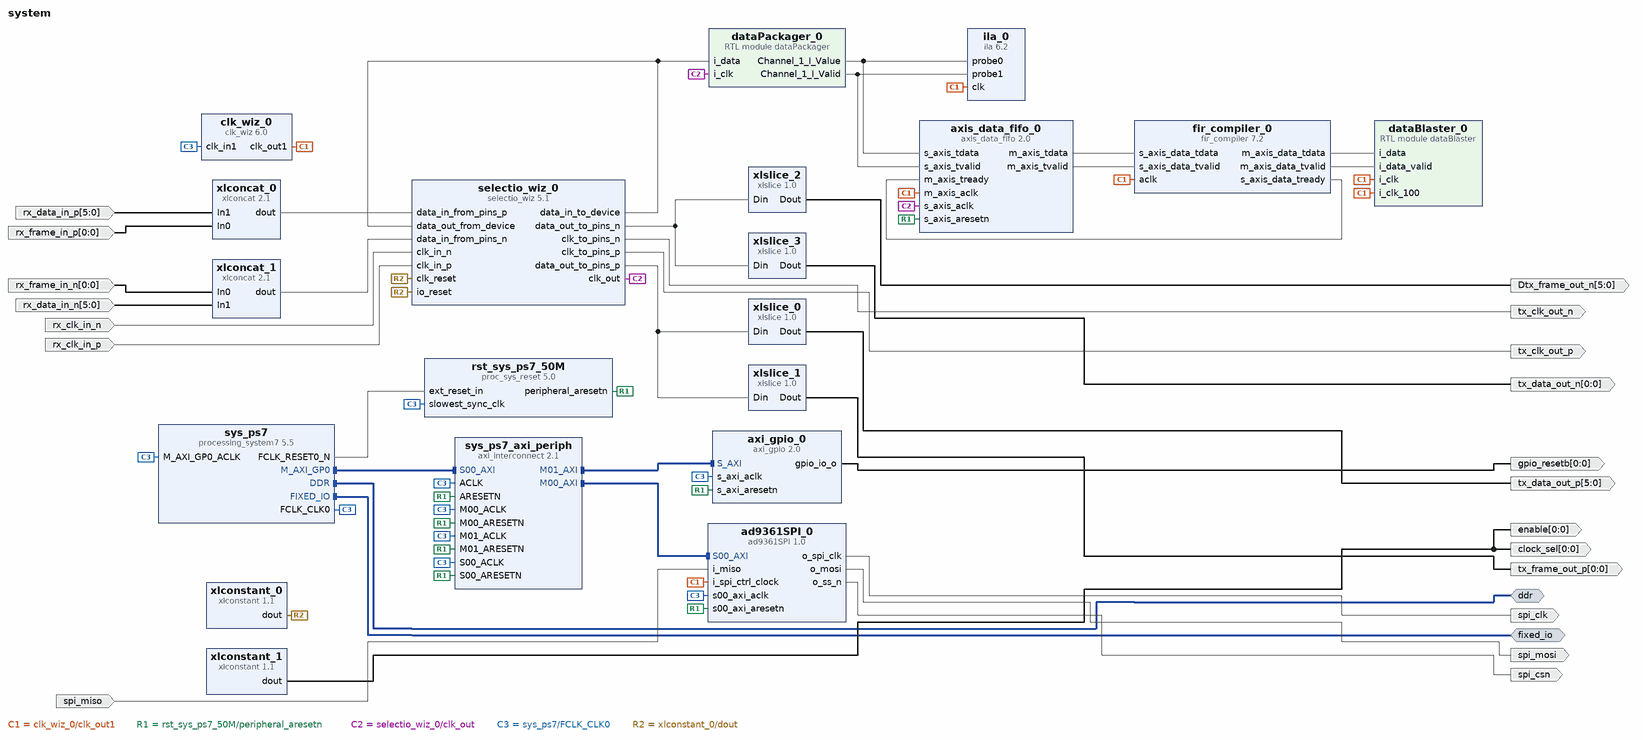
[diagram p0: block diagram of the top level]
# Vivado block design system, xc7z035ifbg676-2L, Vivado 2021.1
create_bd_design system

create_bd_intf_port -mode Master -vlnv xilinx.com:interface:ddrx_rtl:1.0 ddr
create_bd_intf_port -mode Master -vlnv xilinx.com:display_processing_system7:fixedio_rtl:1.0 fixed_io
create_bd_port -dir O spi_mosi
create_bd_port -dir O spi_csn
create_bd_port -dir O -type clk spi_clk
set_property -dict {CONFIG.FREQ_HZ 10000000} [get_bd_ports spi_clk]
create_bd_port -dir I spi_miso
create_bd_port -dir O -from 0 -to 0 gpio_resetb
create_bd_port -dir I -type clk rx_clk_in_n
create_bd_port -dir I -type clk rx_clk_in_p
create_bd_port -dir I -from 0 -to 0 rx_frame_in_p
create_bd_port -dir I -from 5 -to 0 rx_data_in_p
create_bd_port -dir I -from 0 -to 0 rx_frame_in_n
create_bd_port -dir I -from 5 -to 0 rx_data_in_n
create_bd_port -dir O -from 5 -to 0 tx_data_out_p
create_bd_port -dir O -from 0 -to 0 tx_frame_out_p
create_bd_port -dir O -from 5 -to 0 Dtx_frame_out_n
create_bd_port -dir O -from 0 -to 0 tx_data_out_n
create_bd_port -dir O -type clk tx_clk_out_p
create_bd_port -dir O -type clk tx_clk_out_n
create_bd_port -dir O -from 0 -to 0 enable
create_bd_port -dir O -from 0 -to 0 clock_sel

create_bd_cell -type ip -vlnv xilinx.com:ip:processing_system7:5.5 sys_ps7
set_property -dict [list \
  CONFIG.PCW_APU_PERIPHERAL_FREQMHZ 666.666666 \
  CONFIG.PCW_CPU_CPU_6X4X_MAX_RANGE 800 \
  CONFIG.PCW_ENET0_PERIPHERAL_ENABLE 0 \
  CONFIG.PCW_ENET1_PERIPHERAL_CLKSRC External \
  CONFIG.PCW_FPGA0_PERIPHERAL_FREQMHZ 100 \
  CONFIG.PCW_FPGA1_PERIPHERAL_FREQMHZ 200.0 \
  CONFIG.PCW_FPGA2_PERIPHERAL_FREQMHZ 200.0 \
  CONFIG.PCW_GPIO_MIO_GPIO_ENABLE 0 \
  CONFIG.PCW_IRQ_F2P_INTR 1 \
  CONFIG.PCW_IRQ_F2P_MODE REVERSE \
  CONFIG.PCW_PERIPHERAL_BOARD_PRESET None \
  CONFIG.PCW_PRESET_BANK0_VOLTAGE {LVCMOS 1.8V} \
  CONFIG.PCW_PRESET_BANK1_VOLTAGE {LVCMOS 1.8V} \
  CONFIG.PCW_QSPI_PERIPHERAL_ENABLE 0 \
  CONFIG.PCW_SD0_PERIPHERAL_ENABLE 0 \
  CONFIG.PCW_UART1_PERIPHERAL_ENABLE 1 \
  CONFIG.PCW_UART1_UART1_IO {MIO 48 .. 49} \
  CONFIG.PCW_UART_PERIPHERAL_FREQMHZ 100 \
  CONFIG.PCW_UIPARAM_DDR_FREQ_MHZ 533.333333 \
  CONFIG.PCW_UIPARAM_DDR_PARTNO {MT41K256M16 RE-125} \
  CONFIG.PCW_USB0_PERIPHERAL_ENABLE 0 \
  CONFIG.PCW_USE_FABRIC_INTERRUPT 1 \
  CONFIG.preset None \
] [get_bd_cells sys_ps7]
# 343 more settings of sys_ps7 are not shown: defaults, MIO pin electricals, DDR timing, and values the tool derives
create_bd_cell -type ip -vlnv xilinx.com:ip:axi_interconnect:2.1 sys_ps7_axi_periph
set_property -dict {CONFIG.NUM_MI 2} [get_bd_cells sys_ps7_axi_periph]
create_bd_cell -type ip -vlnv xilinx.com:ip:proc_sys_reset:5.0 rst_sys_ps7_50M
create_bd_cell -type ip -vlnv xilinx.com:ip:clk_wiz:6.0 clk_wiz_0
set_property -dict [list \
  CONFIG.CLKIN1_JITTER_PS 100.0 \
  CONFIG.CLKOUT1_JITTER 290.478 \
  CONFIG.CLKOUT1_PHASE_ERROR 133.882 \
  CONFIG.CLKOUT1_REQUESTED_OUT_FREQ 10.000 \
  CONFIG.MMCM_CLKFBOUT_MULT_F 15.625 \
  CONFIG.MMCM_CLKIN1_PERIOD 10.000 \
  CONFIG.MMCM_CLKIN2_PERIOD 10.000 \
  CONFIG.MMCM_CLKOUT0_DIVIDE_F 78.125 \
  CONFIG.MMCM_DIVCLK_DIVIDE 2 \
  CONFIG.USE_LOCKED false \
  CONFIG.USE_RESET false \
] [get_bd_cells clk_wiz_0]
create_bd_cell -type ip -vlnv xilinx.com:ip:axi_gpio:2.0 axi_gpio_0
set_property -dict {CONFIG.C_ALL_OUTPUTS 1 CONFIG.C_DOUT_DEFAULT 0x00000001 CONFIG.C_GPIO_WIDTH 1} [get_bd_cells axi_gpio_0]
create_bd_cell -type ip -vlnv xilinx.com:ip:selectio_wiz:5.1 selectio_wiz_0
set_property -dict [list \
  CONFIG.BUS_DIR SEPARATE \
  CONFIG.BUS_IO_STD LVDS \
  CONFIG.BUS_SIG_TYPE DIFF \
  CONFIG.CLK_FWD true \
  CONFIG.CLK_FWD_IO_STD LVDS \
  CONFIG.CLK_FWD_SIG_TYPE DIFF \
  CONFIG.SELIO_ACTIVE_EDGE DDR \
  CONFIG.SELIO_BUS_IN_DELAY NONE \
  CONFIG.SELIO_CLK_IO_STD LVDS \
  CONFIG.SELIO_CLK_SIG_TYPE DIFF \
  CONFIG.SELIO_DDR_ALIGNMENT OPPOSITE_EDGE \
  CONFIG.SELIO_INTERFACE_TYPE NETWORKING \
  CONFIG.SELIO_ODDR_ALIGNMENT OPPOSITE_EDGE \
  CONFIG.SERIALIZATION_FACTOR 4 \
  CONFIG.SYSTEM_DATA_WIDTH 7 \
] [get_bd_cells selectio_wiz_0]
create_bd_cell -type ip -vlnv xilinx.com:ip:xlconcat:2.1 xlconcat_0
set_property -dict {CONFIG.IN0_WIDTH 1 CONFIG.IN1_WIDTH 6} [get_bd_cells xlconcat_0]
create_bd_cell -type ip -vlnv xilinx.com:ip:xlconcat:2.1 xlconcat_1
set_property -dict {CONFIG.IN0_WIDTH 1 CONFIG.IN1_WIDTH 6} [get_bd_cells xlconcat_1]
create_bd_cell -type ip -vlnv xilinx.com:ip:xlconstant:1.1 xlconstant_0
set_property -dict {CONFIG.CONST_VAL 0} [get_bd_cells xlconstant_0]
create_bd_cell -type ip -vlnv xilinx.com:ip:xlslice:1.0 xlslice_0
set_property -dict {CONFIG.DIN_FROM 6 CONFIG.DIN_TO 1 CONFIG.DIN_WIDTH 7 CONFIG.DOUT_WIDTH 6} [get_bd_cells xlslice_0]
create_bd_cell -type ip -vlnv xilinx.com:ip:xlslice:1.0 xlslice_1
set_property -dict {CONFIG.DIN_WIDTH 7} [get_bd_cells xlslice_1]
create_bd_cell -type ip -vlnv xilinx.com:ip:xlslice:1.0 xlslice_2
set_property -dict {CONFIG.DIN_FROM 6 CONFIG.DIN_TO 1 CONFIG.DIN_WIDTH 7 CONFIG.DOUT_WIDTH 6} [get_bd_cells xlslice_2]
create_bd_cell -type ip -vlnv xilinx.com:ip:xlslice:1.0 xlslice_3
set_property -dict {CONFIG.DIN_WIDTH 7} [get_bd_cells xlslice_3]
create_bd_cell -type ip -vlnv xilinx.com:ip:xlconstant:1.1 xlconstant_1
create_bd_cell -type ip -vlnv xilinx.com:user:ad9361SPI:1.0 ad9361SPI_0
create_bd_cell -type module -reference dataPackager dataPackager_0
create_bd_cell -type ip -vlnv xilinx.com:ip:fir_compiler:7.2 fir_compiler_0
set_property -dict [list \
  CONFIG.BestPrecision false \
  CONFIG.Clock_Frequency 10 \
  CONFIG.CoefficientVector -9.84925826310081e-05,-0.00110868863542213,-0.00360880865416567,-0.00738997179946688,-0.0105821355373124,-0.0104770713158961,-0.00576969500974908,0.00146429798420476,0.00643664485734270,0.00533981936990165,-0.000819920483685010,-0.00628361278568368,-0.00546718426875868,0.00134326282720413,0.00746917261520295,0.00607762211423573,-0.00236982350206959,-0.00946259607779683,-0.00694148672694505,0.00395630902383487,0.0122354284456056,0.00792249159172272,-0.00634207600108948,-0.0159719042373950,-0.00891354338210485,0.00997947924793755,0.0211410628800746,0.00983603012199917,-0.0157534148009865,-0.0288344572866765,-0.0106367968557134,0.0257925713549861,0.0420529150204102,0.0112543877848733,-0.0473372555721501,-0.0729943026596861,-0.0116281947059571,0.131135621874419,0.281121067168514,0.345106159081915,0.281121067168514,0.131135621874419,-0.0116281947059571,-0.0729943026596861,-0.0473372555721501,0.0112543877848733,0.0420529150204102,0.0257925713549861,-0.0106367968557134,-0.0288344572866765,-0.0157534148009865,0.00983603012199917,0.0211410628800746,0.00997947924793755,-0.00891354338210485,-0.0159719042373950,-0.00634207600108948,0.00792249159172272,0.0122354284456056,0.00395630902383487,-0.00694148672694505,-0.00946259607779683,-0.00236982350206959,0.00607762211423573,0.00746917261520295,0.00134326282720413,-0.00546718426875868,-0.00628361278568368,-0.000819920483685010,0.00533981936990165,0.00643664485734270,0.00146429798420476,-0.00576969500974908,-0.0104770713158961,-0.0105821355373124,-0.00738997179946688,-0.00360880865416567,-0.00110868863542213,-9.84925826310081e-05 \
  CONFIG.Coefficient_Fractional_Bits 49 \
  CONFIG.Coefficient_Sets 1 \
  CONFIG.Coefficient_Sign Signed \
  CONFIG.Coefficient_Structure Inferred \
  CONFIG.Coefficient_Width 49 \
  CONFIG.ColumnConfig 2 \
  CONFIG.Data_Fractional_Bits 10 \
  CONFIG.Data_Sign Signed \
  CONFIG.Data_Width 12 \
  CONFIG.Decimation_Rate 2 \
  CONFIG.Filter_Architecture Systolic_Multiply_Accumulate \
  CONFIG.Filter_Type Decimation \
  CONFIG.Interpolation_Rate 1 \
  CONFIG.Number_Channels 1 \
  CONFIG.Output_Rounding_Mode Truncate_LSBs \
  CONFIG.Output_Width 16 \
  CONFIG.Quantization Quantize_Only \
  CONFIG.RateSpecification Frequency_Specification \
  CONFIG.Sample_Frequency 0.768 \
  CONFIG.Zero_Pack_Factor 1 \
] [get_bd_cells fir_compiler_0]
create_bd_cell -type ip -vlnv xilinx.com:ip:axis_data_fifo:2.0 axis_data_fifo_0
set_property -dict {CONFIG.FIFO_DEPTH 256 CONFIG.IS_ACLK_ASYNC 1 CONFIG.TDATA_NUM_BYTES 2} [get_bd_cells axis_data_fifo_0]
create_bd_cell -type module -reference dataBlaster dataBlaster_0
create_bd_cell -type ip -vlnv xilinx.com:ip:ila:6.2 ila_0
set_property -dict [list \
  CONFIG.C_DATA_DEPTH 4096 \
  CONFIG.C_ENABLE_ILA_AXI_MON false \
  CONFIG.C_MONITOR_TYPE Native \
  CONFIG.C_NUM_OF_PROBES 2 \
] [get_bd_cells ila_0]

# ---- connections ----

connect_bd_intf_net [get_bd_intf_ports ddr] [get_bd_intf_pins sys_ps7/DDR]
connect_bd_intf_net [get_bd_intf_ports fixed_io] [get_bd_intf_pins sys_ps7/FIXED_IO]
connect_bd_intf_net [get_bd_intf_pins sys_ps7/M_AXI_GP0] [get_bd_intf_pins sys_ps7_axi_periph/S00_AXI]
connect_bd_intf_net [get_bd_intf_pins sys_ps7_axi_periph/M00_AXI] [get_bd_intf_pins ad9361SPI_0/S00_AXI]
connect_bd_intf_net [get_bd_intf_pins sys_ps7_axi_periph/M01_AXI] [get_bd_intf_pins axi_gpio_0/S_AXI]
connect_bd_net -net In0_1_1 [get_bd_ports rx_frame_in_n] [get_bd_pins xlconcat_1/In0]
connect_bd_net -net In1_0_1 [get_bd_ports rx_data_in_p] [get_bd_pins xlconcat_0/In1]
connect_bd_net -net In1_1_1 [get_bd_ports rx_data_in_n] [get_bd_pins xlconcat_1/In1]
connect_bd_net [get_bd_pins fir_compiler_0/s_axis_data_tready] [get_bd_pins axis_data_fifo_0/m_axis_tready]
connect_bd_net [get_bd_pins ad9361SPI_0/o_mosi] [get_bd_ports spi_mosi]
connect_bd_net [get_bd_pins ad9361SPI_0/o_spi_clk] [get_bd_ports spi_clk]
connect_bd_net [get_bd_pins ad9361SPI_0/o_ss_n] [get_bd_ports spi_csn]
connect_bd_net [get_bd_pins axi_gpio_0/gpio_io_o] [get_bd_ports gpio_resetb]
connect_bd_net [get_bd_pins axis_data_fifo_0/m_axis_tdata] [get_bd_pins fir_compiler_0/s_axis_data_tdata]
connect_bd_net [get_bd_pins axis_data_fifo_0/m_axis_tvalid] [get_bd_pins fir_compiler_0/s_axis_data_tvalid]
connect_bd_net -net clk_in_n_0_1 [get_bd_ports rx_clk_in_n] [get_bd_pins selectio_wiz_0/clk_in_n]
connect_bd_net -net clk_in_p_0_1 [get_bd_ports rx_clk_in_p] [get_bd_pins selectio_wiz_0/clk_in_p]
connect_bd_net [get_bd_pins clk_wiz_0/clk_out1] \
  [get_bd_pins ad9361SPI_0/i_spi_ctrl_clock] [get_bd_pins axis_data_fifo_0/m_axis_aclk] [get_bd_pins fir_compiler_0/aclk] \
  [get_bd_pins dataBlaster_0/i_clk] [get_bd_pins dataBlaster_0/i_clk_100] [get_bd_pins ila_0/clk]
connect_bd_net -net dataPackager_0_Q_Value [get_bd_pins dataPackager_0/Channel_1_I_Value] \
  [get_bd_pins axis_data_fifo_0/s_axis_tdata] [get_bd_pins ila_0/probe0]
connect_bd_net -net dataPackager_0_o_Q_Valid [get_bd_pins dataPackager_0/Channel_1_I_Valid] \
  [get_bd_pins axis_data_fifo_0/s_axis_tvalid] [get_bd_pins ila_0/probe1]
connect_bd_net [get_bd_pins fir_compiler_0/m_axis_data_tdata] [get_bd_pins dataBlaster_0/i_data]
connect_bd_net [get_bd_pins fir_compiler_0/m_axis_data_tvalid] [get_bd_pins dataBlaster_0/i_data_valid]
connect_bd_net -net i_miso_0_1 [get_bd_ports spi_miso] [get_bd_pins ad9361SPI_0/i_miso]
connect_bd_net [get_bd_pins rst_sys_ps7_50M/peripheral_aresetn] \
  [get_bd_pins sys_ps7_axi_periph/S00_ARESETN] [get_bd_pins sys_ps7_axi_periph/M00_ARESETN] \
  [get_bd_pins sys_ps7_axi_periph/ARESETN] [get_bd_pins axi_gpio_0/s_axi_aresetn] \
  [get_bd_pins sys_ps7_axi_periph/M01_ARESETN] [get_bd_pins ad9361SPI_0/s00_axi_aresetn] \
  [get_bd_pins axis_data_fifo_0/s_axis_aresetn]
connect_bd_net [get_bd_ports rx_frame_in_p] [get_bd_pins xlconcat_0/In0]
connect_bd_net [get_bd_pins selectio_wiz_0/clk_out] [get_bd_pins dataPackager_0/i_clk] [get_bd_pins axis_data_fifo_0/s_axis_aclk]
connect_bd_net [get_bd_pins selectio_wiz_0/clk_to_pins_n] [get_bd_ports tx_clk_out_n]
connect_bd_net [get_bd_pins selectio_wiz_0/clk_to_pins_p] [get_bd_ports tx_clk_out_p]
connect_bd_net [get_bd_pins selectio_wiz_0/data_in_to_device] [get_bd_pins selectio_wiz_0/data_out_from_device] [get_bd_pins dataPackager_0/i_data]
connect_bd_net [get_bd_pins selectio_wiz_0/data_out_to_pins_n] [get_bd_pins xlslice_2/Din] [get_bd_pins xlslice_3/Din]
connect_bd_net [get_bd_pins selectio_wiz_0/data_out_to_pins_p] [get_bd_pins xlslice_0/Din] [get_bd_pins xlslice_1/Din]
connect_bd_net -net sys_cpu_clk [get_bd_pins sys_ps7/FCLK_CLK0] \
  [get_bd_pins sys_ps7/M_AXI_GP0_ACLK] [get_bd_pins sys_ps7_axi_periph/S00_ACLK] \
  [get_bd_pins rst_sys_ps7_50M/slowest_sync_clk] [get_bd_pins sys_ps7_axi_periph/M00_ACLK] \
  [get_bd_pins sys_ps7_axi_periph/ACLK] [get_bd_pins clk_wiz_0/clk_in1] [get_bd_pins axi_gpio_0/s_axi_aclk] \
  [get_bd_pins sys_ps7_axi_periph/M01_ACLK] [get_bd_pins ad9361SPI_0/s00_axi_aclk]
connect_bd_net [get_bd_pins sys_ps7/FCLK_RESET0_N] [get_bd_pins rst_sys_ps7_50M/ext_reset_in]
connect_bd_net [get_bd_pins xlconcat_0/dout] [get_bd_pins selectio_wiz_0/data_in_from_pins_p]
connect_bd_net [get_bd_pins xlconcat_1/dout] [get_bd_pins selectio_wiz_0/data_in_from_pins_n]
connect_bd_net [get_bd_pins xlconstant_0/dout] [get_bd_pins selectio_wiz_0/io_reset] [get_bd_pins selectio_wiz_0/clk_reset]
connect_bd_net [get_bd_pins xlconstant_1/dout] [get_bd_ports enable] [get_bd_ports clock_sel]
connect_bd_net [get_bd_pins xlslice_0/Dout] [get_bd_ports tx_data_out_p]
connect_bd_net [get_bd_pins xlslice_1/Dout] [get_bd_ports tx_frame_out_p]
connect_bd_net [get_bd_pins xlslice_2/Dout] [get_bd_ports Dtx_frame_out_n]
connect_bd_net [get_bd_pins xlslice_3/Dout] [get_bd_ports tx_data_out_n]

# ---- address map ----
assign_bd_address -offset 0x41200000 -range 64K -target_address_space [get_bd_addr_spaces sys_ps7/Data] [get_bd_addr_segs axi_gpio_0/S_AXI/Reg]
assign_bd_address -offset 0x43C00000 -range 64K -target_address_space [get_bd_addr_spaces sys_ps7/Data] [get_bd_addr_segs ad9361SPI_0/S00_AXI/S00_AXI_reg]

validate_bd_design
save_bd_design
